# Altium schematic sheet ISOLATION.SchDoc
size A4; SheetNumber: 4; SheetTotal: 5
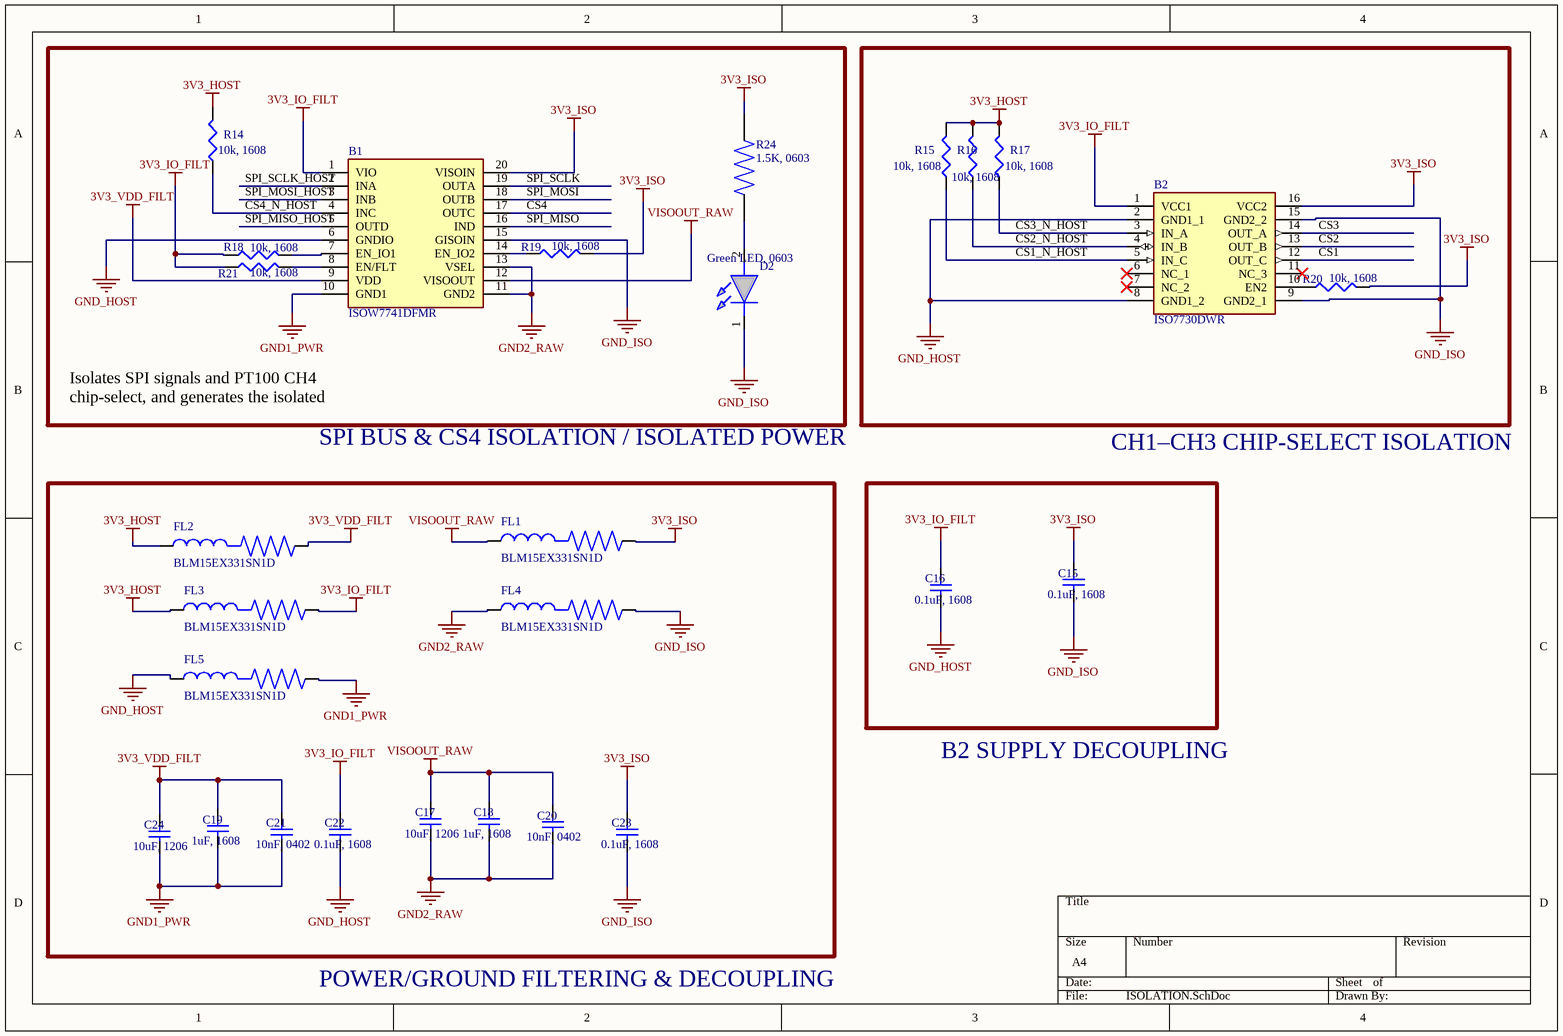
[diagram p0: ISOLATION.SchDoc]

## Parts
B1  ISOW7741DFMR  [SOIC127P1030X355-20N]
B2  ISO7730DWR  [SOIC127P1030X265-16N]
C15  0.1uF, 1608  [1608[0603]]
C16  0.1uF, 1608  [1608[0603]]
C17  10uF, 1206  [C1206]
C18  1uF, 1608  [1608[0603]]
C19  1uF, 1608  [1608[0603]]
C20  10nF, 0402  [0402]
C21  10nF, 0402  [0402]
C22  0.1uF, 1608  [1608[0603]]
C23  0.1uF, 1608  [1608[0603]]
C24  10uF, 1206  [C1206]
D2  Green LED, 0603  [LEDC1608X75N]
FL1  BLM15EX331SN1D  [BEADC1005X55N]
FL2  BLM15EX331SN1D  [BEADC1005X55N]
FL3  BLM15EX331SN1D  [BEADC1005X55N]
FL4  BLM15EX331SN1D  [BEADC1005X55N]
FL5  BLM15EX331SN1D  [BEADC1005X55N]
R14  10k, 1608  [J1-0603]
R15  10k, 1608  [J1-0603]
R16  10k, 1608  [J1-0603]
R17  10k, 1608  [J1-0603]
R18  10k, 1608  [J1-0603]
R19  10k, 1608  [J1-0603]
R20  10k, 1608  [J1-0603]
R21  10k, 1608  [J1-0603]
R24  1.5K, 0603  [RESC1607X60N]

## Nets
3V3_HOST: FL2.1 FL3.1 R14.2 R15.2 R16.2 R17.2
3V3_IO_FILT: B1.1(VIO) B2.1(VCC1) C16.2 C22.2 FL3.2 R18.1 R21.1
3V3_ISO: B1.20(VISOIN) B2.16(VCC2) C15.2 C23.2 FL1.2 R19.2 R20.2 R24.1
3V3_VDD_FILT: B1.9(VDD) C19.2 C21.2 C24.2 FL2.2
GND1_PWR: B1.10(GND1) C19.1 C21.1 C24.1 FL5.2
GND2_RAW: B1.11(GND2) B1.13(VSEL) C17.1 C18.1 C20.1 FL4.1
GND_HOST: B1.6(GNDIO) B2.2(GND1_1) B2.8(GND1_2) C16.1 C22.1 FL5.1
GND_ISO: B1.15(GISOIN) B2.9(GND2_1) B2.15(GND2_2) C15.1 C23.1 D2.1(K) FL4.2
VISOOUT_RAW: B1.12(VISOOUT) C17.2 C18.2 C20.2 FL1.1
CS1: B2.12(OUT_C)
CS1_N_HOST: B2.5(IN_C) R15.1
CS2: B2.13(OUT_B)
CS2_N_HOST: B2.4(IN_B) R16.1
CS3: B2.14(OUT_A)
CS3_N_HOST: B2.3(IN_A) R17.1
CS4: B1.17(OUTC)
CS4_N_HOST: B1.4(INC) R14.1
SPI_MISO: B1.16(IND)
SPI_MISO_HOST: B1.5(OUTD)
SPI_MOSI: B1.18(OUTB)
SPI_MOSI_HOST: B1.3(INB)
SPI_SCLK: B1.19(OUTA)
SPI_SCLK_HOST: B1.2(INA)
NetB1_7: B1.7(EN_IO1) R18.2
NetB1_8: B1.8(EN/FLT) R21.2
NetB1_14: B1.14(EN_IO2) R19.1
NetB2_10: B2.10(EN2) R20.1
NetD2_2: D2.2(A) R24.2

Not connected (* = marked no-connect by the designer): B2 6(NC_1)* 7(NC_2)* 11(NC_3)*

## Notes on the sheet
- Isolates SPI signals and PT100 CH4 chip-select, and generates the isolated supply.
- SPI BUS & CS4 ISOLATION / ISOLATED POWER
- CH1–CH3 CHIP-SELECT ISOLATION
- B2 SUPPLY DECOUPLING
- POWER/GROUND FILTERING & DECOUPLING

## Library data of the parts
B1 = ISOW7741DFMR: ISOW7741 Quad-Channel Digital Isolator with Integrated Low-Emissions, Low-Noise DC-DC Converter; Manufacturer_Name: Texas Instruments; Geometry.Height: 3.55mm; Mouser Part Number: 595-ISOW7741DFMR; Mouser Price/Stock: https://www.mouser.co.uk/ProductDetail/Texas-Instruments/ISOW7741DFMR?qs=TCDPyi3sCW2lvMJ%252B%2FuKOng%3D%3D; Manufacturer_Part_Number: ISOW7741DFMR; Datasheet Link: https://www.ti.com/lit/ds/symlink/isow7741.pdf?ts=1638340822813&ref_url=https%253A%252F%252Fwww.ti.com%252Fproduct%252FISOW7741
B2 = ISO7730DWR: Integrated Circuit; Manufacturer_Name: Texas Instruments; Datasheet Link: http://www.ti.com/lit/gpn/iso7730; Height: 2.65mm; Manufacturer_Part_Number: ISO7730DWR; Mouser Part Number: 595-ISO7730DWR; Mouser Price/Stock: https://www.mouser.co.uk/ProductDetail/Texas-Instruments/ISO7730DWR?qs=d557%2FRYZ0%2FpU9%252BX01Fh6Sw%3D%3D; Arrow Part Number: ISO7730DWR; Arrow Price/Stock: https://www.arrow.com/en/products/iso7730dwr/texas-instruments?region=nac
C15 C16 C18-C23 = Cap Semi: Capacitor (Semiconductor SIM Model); Published: 8-Jun-2000; LatestRevisionDate: 29-May-2009; LatestRevisionNote: IPC-7351 Footprint Added.; PackageReference: C1206; Publisher: Altium Limited; PackageDescription: Chip Capacitor
  C15 C16 C22 C23: Value: 0.1uF
  C18 C19: Value: 1uF
  C20 C21: Value: 10nF
C17 C24 = Cap Semi: C1206C106J3RACTU; Published: 8-Jun-2000; LatestRevisionDate: 29-May-2009; LatestRevisionNote: IPC-7351 Footprint Added.; PackageReference: C1206; Publisher: Altium Limited; PackageDescription: Chip Capacitor; Value: 10uF
D2 = KPH-1608SGC: Green Chip LED 1.6x0.8mm Kingbright KPH-1608SGC, 603 Series Green LED, 568 nm 1608 (0603), Rectangle Lens SMD package; Geometry.Height: 0.75mm; element14 Part Number: *; element14 Price/Stock: *; Manufacturer_Name: Kingbright; Manufacturer_Part_Number: KPH-1608SGC; Datasheet Link: https://kingbright-europe.de/_daten/2013-2015KBE-P005-023-SMD-LED.pdf
FL1-FL5 = BLM15EX331SN1D: 330 Ohms @ 100 MHz 1 Power, Signal Line Ferrite Bead 0402 (1005 Metric) 1.1A 205mOhm; MF: Murata; SnapEDA_Link: https://www.snapeda.com/parts/BLM15EX331SN1D/Murata/view-part/?ref=snap; Package: 1005 Taiyo Yuden; Value: *; MP: BLM15EX331SN1D; Check_prices: https://www.snapeda.com/parts/BLM15EX331SN1D/Murata/view-part/?ref=eda
R14-R21 = Res3: Resistor; Published: 8-Jun-2000; LatestRevisionDate: 29-May-2009; LatestRevisionNote: IPC-7351 Footprint Added.; PackageReference: J1-0603; Publisher: Altium Limited; PackageDescription: Chip Resistor; Value: 10k
R24 = RC0603FR-071K5L: 1.5 kOhms Â±1% 0.1W, 1/10W Chip Resistor 0603 (1608 Metric) Moisture Resistant Thick Film; MF: Yageo; SnapEDA_Link: https://www.snapeda.com/parts/RC0603FR-071K5L/Yageo/view-part/?ref=snap; Package: 0603 Yageo; Value: *; MP: RC0603FR-071K5L; Check_prices: https://www.snapeda.com/parts/RC0603FR-071K5L/Yageo/view-part/?ref=eda